# Altium schematic sheet BLOCK DIAGRAM.SchDoc
size A3; SheetNumber: 1; SheetTotal: 1
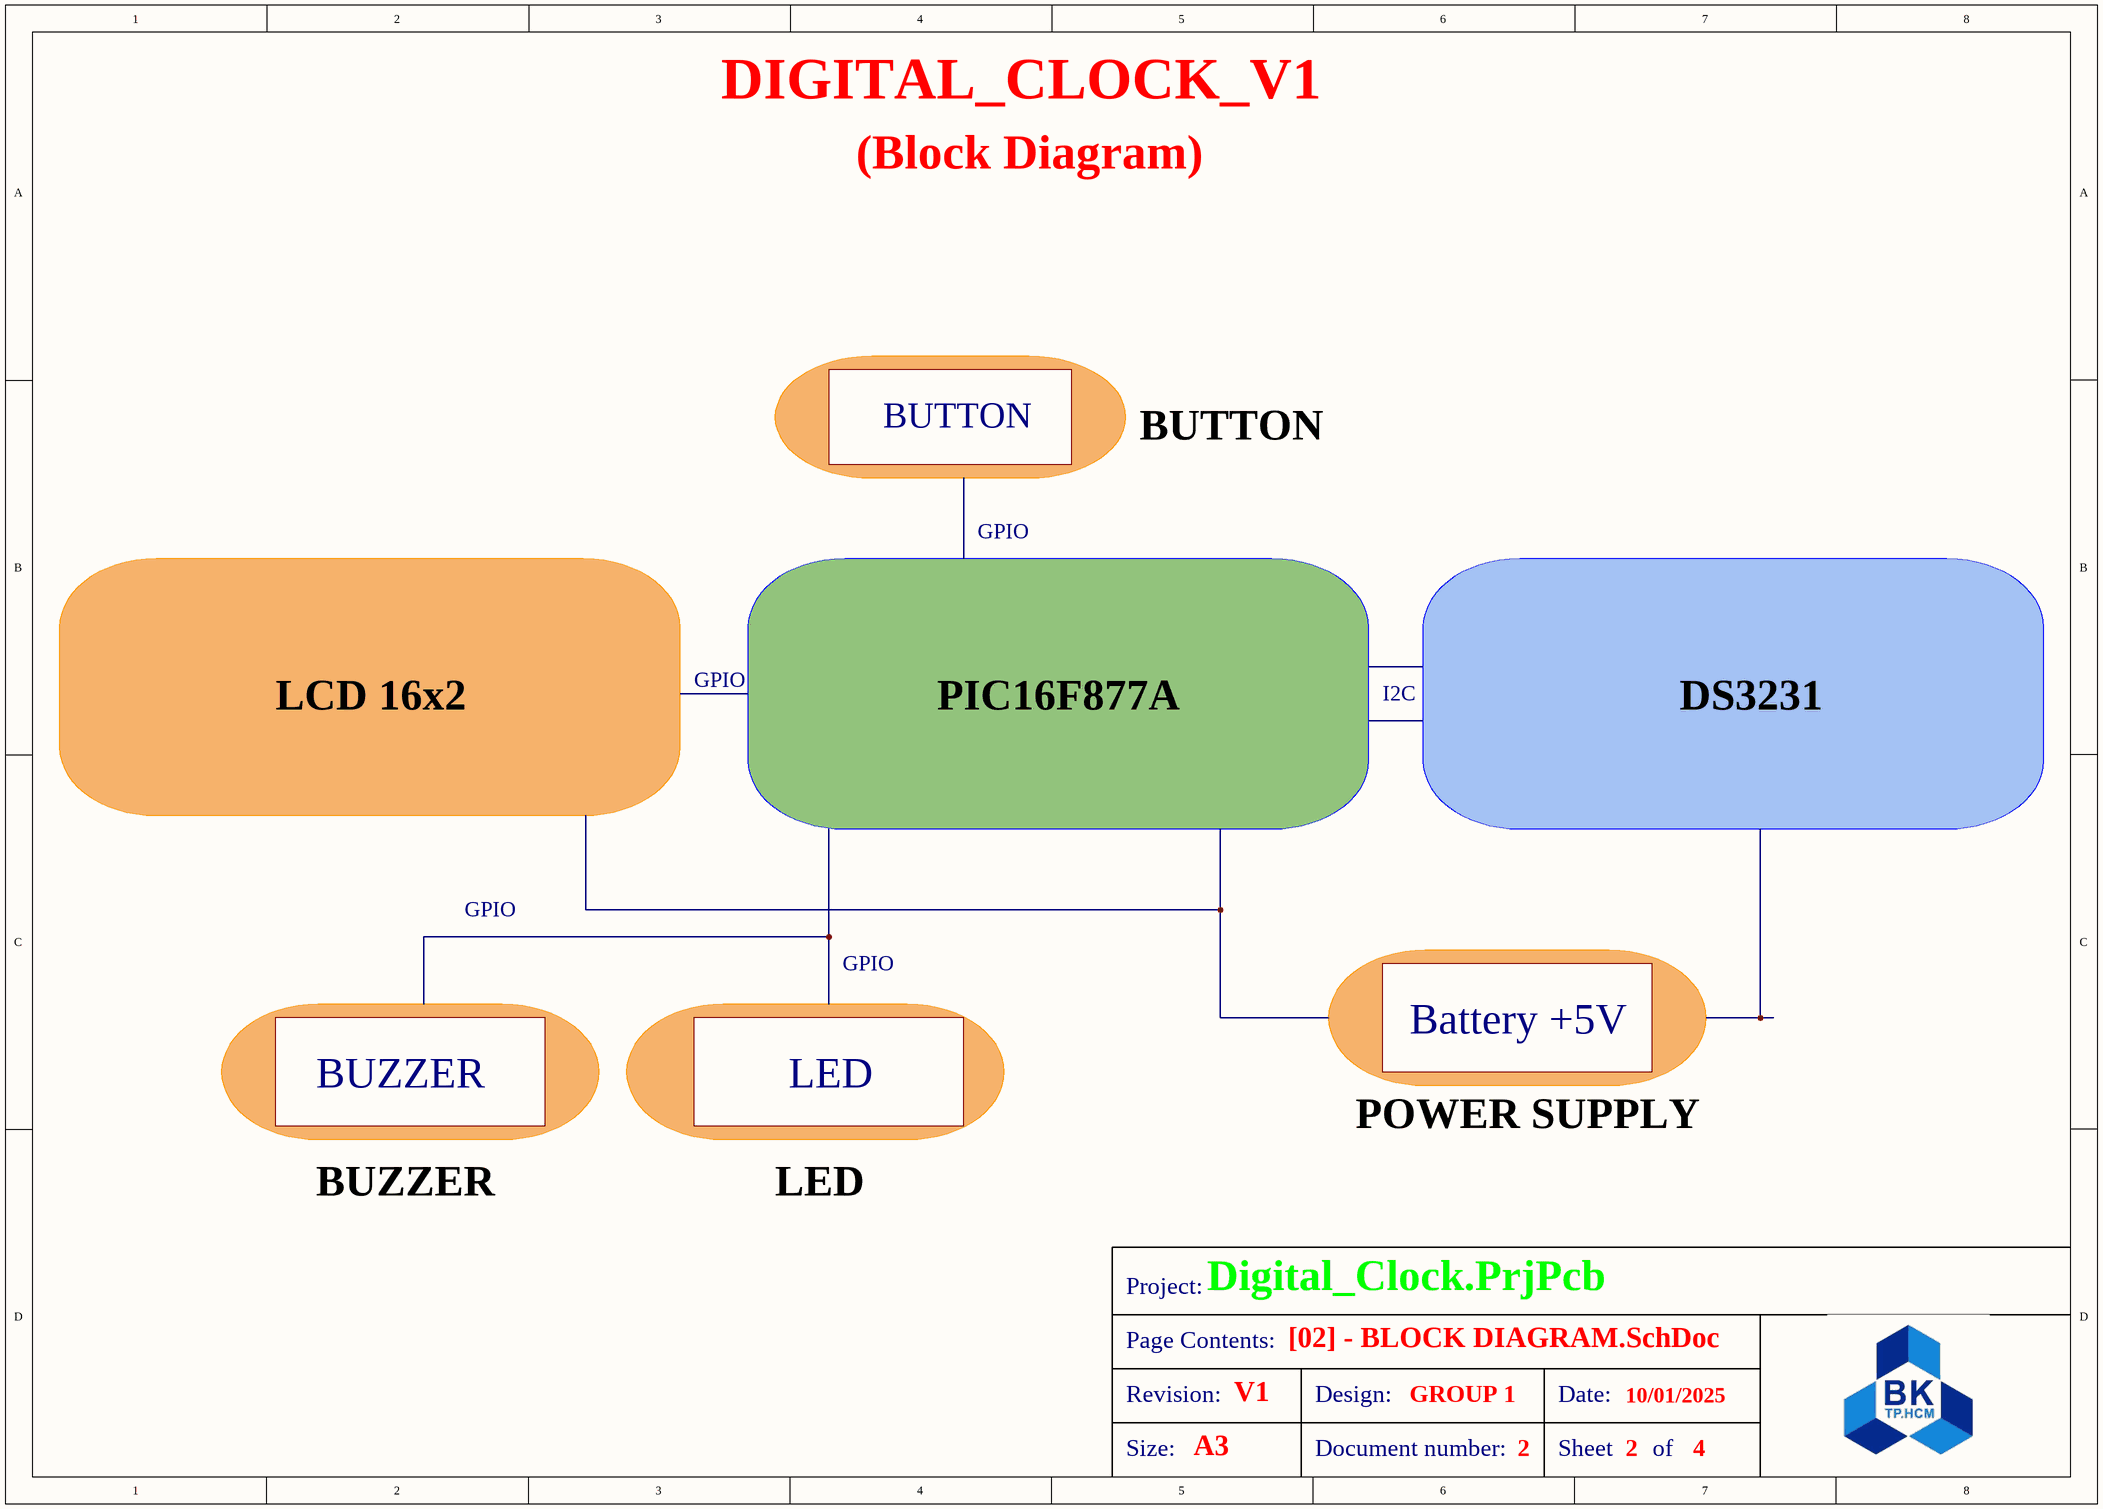
[diagram p0: BLOCK DIAGRAM.SchDoc]

## Notes on the sheet
- DIGITAL_CLOCK_V1
- (Block Diagram)
- BUTTON
- GPIO
- LCD 16x2
- PIC16F877A
- I2C
- DS3231
- Battery +5V
- BUZZER
- LED
- POWER SUPPLY
- [02] - BLOCK DIAGRAM.SchDoc
- A3
- V1
- GROUP 1
- 2
- 10/01/2025
- 4
- Project:
- Digital_Clock.PrjPcb
- Page Contents:
- Revision:
- Size:
- Design:
- Document number:
- Date:
- Sheet
- of